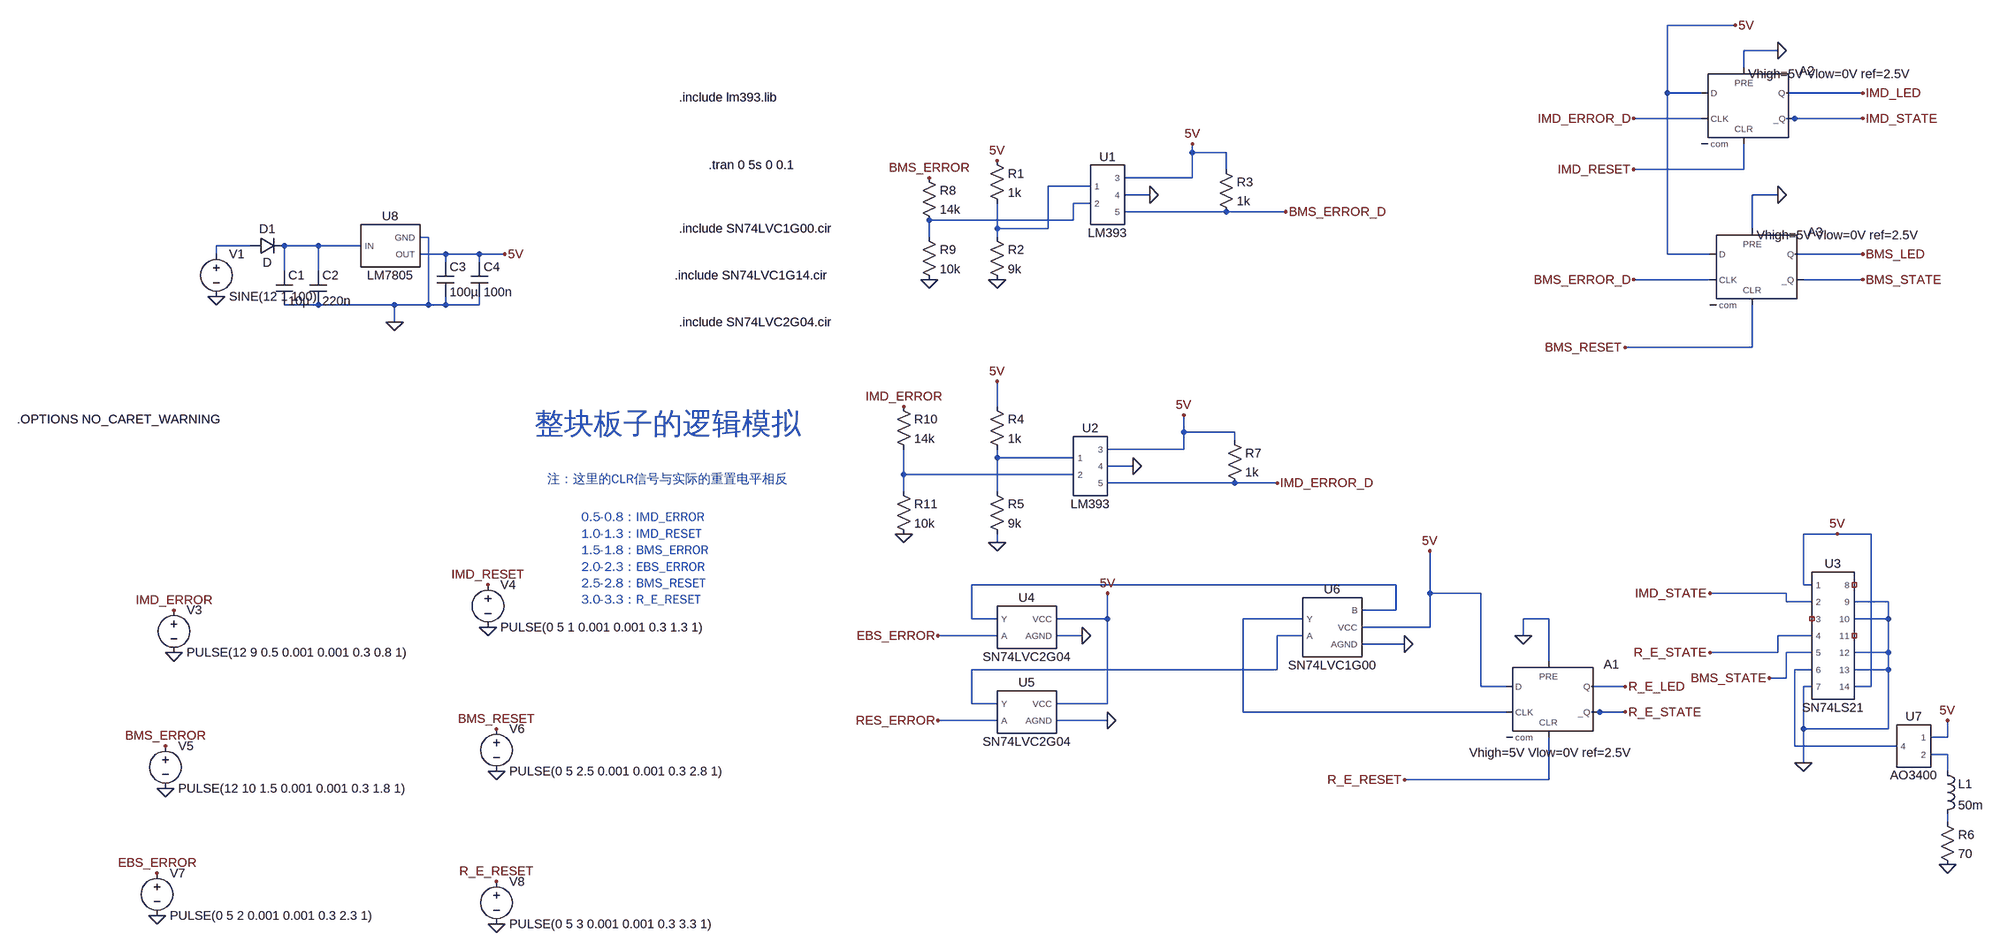
[diagram p0: schematic full.asc]
full.asc, the LTspice schematic file:
Version 4.1
SHEET 1 2420 1492
WIRE 1264 -224 1136 -224
WIRE 1344 -176 1280 -176
WIRE 1280 -144 1280 -176
WIRE 1136 -96 1136 -224
WIRE 1200 -96 1136 -96
WIRE 1504 -96 1360 -96
WIRE 1200 -48 1072 -48
WIRE 1376 -48 1360 -48
WIRE 1504 -48 1376 -48
WIRE 240 16 240 0
WIRE 304 16 240 16
WIRE 304 48 304 16
WIRE 1280 48 1280 0
WIRE 1280 48 1072 48
WIRE 240 64 240 16
WIRE 240 64 112 64
WIRE 48 80 -32 80
WIRE 160 96 112 96
WIRE 1344 96 1296 96
WIRE 48 112 16 112
WIRE 304 128 112 128
WIRE 416 128 304 128
WIRE 16 144 16 112
WIRE 16 144 -256 144
WIRE -128 160 -128 112
WIRE -32 160 -32 80
WIRE -32 160 -128 160
WIRE 1296 160 1296 96
WIRE -1200 176 -1216 176
WIRE -256 176 -256 144
WIRE -128 176 -128 160
WIRE -1536 192 -1600 192
WIRE -1408 192 -1472 192
WIRE -1328 192 -1408 192
WIRE -1600 208 -1600 192
WIRE -1168 208 -1216 208
WIRE -1104 208 -1168 208
WIRE -1056 208 -1104 208
WIRE 1136 208 1136 -96
WIRE 1216 208 1136 208
WIRE 1504 208 1376 208
WIRE -1168 224 -1168 208
WIRE -1104 224 -1104 208
WIRE -1472 240 -1472 192
WIRE -1408 240 -1408 192
WIRE 1216 256 1072 256
WIRE 1504 256 1392 256
WIRE -1408 304 -1472 304
WIRE -1264 304 -1408 304
WIRE -1200 304 -1200 176
WIRE -1200 304 -1264 304
WIRE -1168 304 -1168 288
WIRE -1168 304 -1200 304
WIRE -1104 304 -1104 288
WIRE -1104 304 -1168 304
WIRE -1264 336 -1264 304
WIRE 1296 384 1296 304
WIRE 1296 384 1056 384
WIRE -128 496 -128 448
WIRE 224 544 224 512
WIRE 320 544 224 544
WIRE 320 560 320 544
WIRE 224 576 224 544
WIRE 224 576 80 576
WIRE -128 592 -128 576
WIRE 16 592 -128 592
WIRE 128 608 80 608
WIRE -304 624 -304 576
WIRE 16 624 -304 624
WIRE 320 640 80 640
WIRE 400 640 320 640
WIRE -304 656 -304 624
WIRE -128 656 -128 592
WIRE 1456 736 1392 736
WIRE 1520 736 1456 736
WIRE -128 752 -128 736
WIRE 624 832 -176 832
WIRE 1392 832 1392 736
WIRE 1408 832 1392 832
WIRE 688 848 688 768
WIRE 784 848 688 848
WIRE 1360 848 1216 848
WIRE 1360 864 1360 848
WIRE 1408 864 1360 864
WIRE 1552 864 1488 864
WIRE 624 880 624 832
WIRE 624 880 560 880
WIRE -176 896 -176 832
WIRE -128 896 -176 896
WIRE 80 896 80 848
WIRE 80 896 -16 896
WIRE 448 896 336 896
WIRE 912 896 864 896
WIRE 1552 896 1552 864
WIRE 1552 896 1488 896
WIRE 688 912 688 848
WIRE 688 912 560 912
WIRE -128 928 -240 928
WIRE 32 928 -16 928
WIRE 448 928 400 928
WIRE 864 928 864 896
WIRE 1408 928 1344 928
WIRE 640 944 560 944
WIRE 1344 960 1344 928
WIRE 1344 960 1216 960
WIRE 1408 960 1360 960
WIRE 1552 960 1552 896
WIRE 1552 960 1488 960
WIRE 912 976 912 896
WIRE 400 992 400 928
WIRE 400 992 -176 992
WIRE 1408 992 1376 992
WIRE 1552 992 1552 960
WIRE 1552 992 1488 992
WIRE 1360 1008 1360 960
WIRE 1360 1008 1328 1008
WIRE 784 1024 784 848
WIRE 832 1024 784 1024
WIRE 1056 1024 992 1024
WIRE 1408 1024 1392 1024
WIRE 1520 1024 1520 736
WIRE 1520 1024 1488 1024
WIRE -176 1056 -176 992
WIRE -128 1056 -176 1056
WIRE 80 1056 80 896
WIRE 80 1056 -16 1056
WIRE 336 1072 336 896
WIRE 832 1072 336 1072
WIRE 1008 1072 992 1072
WIRE 1056 1072 1008 1072
WIRE -128 1088 -240 1088
WIRE 80 1088 -16 1088
WIRE 1392 1104 1392 1024
WIRE 1552 1104 1552 992
WIRE 1552 1104 1392 1104
WIRE 1664 1120 1664 1088
WIRE 1664 1120 1632 1120
WIRE 1376 1136 1376 992
WIRE 1568 1136 1376 1136
WIRE 1664 1152 1632 1152
WIRE 1392 1168 1392 1104
WIRE 1664 1184 1664 1152
WIRE 912 1200 912 1120
WIRE 912 1200 640 1200
WIRE 1664 1280 1664 1264
FLAG -128 32 5V
FLAG -128 256 0
FLAG 240 0 5V
FLAG 416 128 BMS_ERROR_D
FLAG -128 448 5V
FLAG -128 752 0
FLAG 224 512 5V
FLAG 400 640 IMD_ERROR_D
FLAG 80 848 5V
FLAG 80 1088 0
FLAG -240 928 EBS_ERROR
FLAG -240 1088 RES_ERROR
FLAG 688 768 5V
FLAG 640 944 0
FLAG 640 1200 R_E_RESET
FLAG 864 928 0
FLAG 1056 1072 R_E_STATE
FLAG 1056 1024 R_E_LED
FLAG 1264 -224 5V
FLAG 1072 -48 IMD_ERROR_D
FLAG 1072 256 BMS_ERROR_D
FLAG 1072 48 IMD_RESET
FLAG 1056 384 BMS_RESET
FLAG 1504 256 BMS_STATE
FLAG 1504 -48 IMD_STATE
FLAG 1504 -96 IMD_LED
FLAG 1504 208 BMS_LED
FLAG 1216 960 R_E_STATE
FLAG 1216 848 IMD_STATE
FLAG 1328 1008 BMS_STATE
FLAG -1680 960 0
FLAG -1680 880 IMD_ERROR
FLAG 32 928 0
FLAG -1088 912 0
FLAG -1088 832 IMD_RESET
FLAG -1696 1216 0
FLAG -1072 1184 0
FLAG -1696 1136 BMS_ERROR
FLAG -1072 1104 BMS_RESET
FLAG -1712 1376 EBS_ERROR
FLAG -1712 1456 0
FLAG -1072 1472 0
FLAG -1072 1392 R_E_RESET
FLAG 1344 96 0
FLAG 1344 -176 0
FLAG 128 608 0
FLAG 160 96 0
FLAG 1392 1168 0
FLAG 1456 736 5V
FLAG 1664 1360 0
FLAG 1664 1088 5V
FLAG -1264 336 0
FLAG -1600 288 0
FLAG -1056 208 5V
FLAG -256 64 BMS_ERROR
FLAG -256 256 0
FLAG -304 496 IMD_ERROR
FLAG -304 736 0
SYMBOL res -144 16 R0
SYMATTR InstName R1
SYMATTR Value 1k
SYMBOL res -144 160 R0
SYMATTR InstName R2
SYMATTR Value 9k
SYMBOL res 288 32 R0
SYMATTR InstName R3
SYMATTR Value 1k
SYMBOL res -144 480 R0
SYMATTR InstName R4
SYMATTR Value 1k
SYMBOL res -144 640 R0
SYMATTR InstName R5
SYMATTR Value 9k
SYMBOL res 304 544 R0
SYMATTR InstName R7
SYMATTR Value 1k
SYMBOL SN74LVC2G04 -80 912 R0
SYMATTR InstName U4
SYMBOL SN74LVC2G04 -80 1072 R0
SYMATTR InstName U5
SYMBOL SN74LVC1G00 496 912 R0
SYMATTR InstName U6
SYMBOL Digital\\dflop 912 976 R0
WINDOW 3 -150 173 Left 2
SYMATTR Value Vhigh=5V Vlow=0V ref=2.5V
SYMATTR InstName A1
SYMBOL Digital\\dflop 1280 -144 R0
WINDOW 3 8 12 Left 2
SYMATTR Value Vhigh=5V Vlow=0V ref=2.5V
SYMATTR InstName A2
SYMBOL Digital\\dflop 1296 160 R0
WINDOW 3 8 12 Left 2
SYMATTR Value Vhigh=5V Vlow=0V ref=2.5V
SYMATTR InstName A3
SYMBOL voltage -1680 864 R0
WINDOW 123 0 0 Left 0
WINDOW 39 0 0 Left 0
SYMATTR InstName V3
SYMATTR Value PULSE(12 9 0.5 0.001 0.001 0.3 0.8 1)
SYMBOL voltage -1088 816 R0
WINDOW 123 0 0 Left 0
WINDOW 39 0 0 Left 0
SYMATTR InstName V4
SYMATTR Value PULSE(0 5 1 0.001 0.001 0.3 1.3 1)
SYMBOL voltage -1696 1120 R0
WINDOW 123 0 0 Left 0
WINDOW 39 0 0 Left 0
SYMATTR InstName V5
SYMATTR Value PULSE(12 10 1.5 0.001 0.001 0.3 1.8 1)
SYMBOL voltage -1072 1088 R0
WINDOW 123 0 0 Left 0
WINDOW 39 0 0 Left 0
SYMATTR InstName V6
SYMATTR Value PULSE(0 5 2.5 0.001 0.001 0.3 2.8 1)
SYMBOL voltage -1712 1360 R0
WINDOW 123 0 0 Left 0
WINDOW 39 0 0 Left 0
SYMATTR InstName V7
SYMATTR Value PULSE(0 5 2 0.001 0.001 0.3 2.3 1)
SYMBOL voltage -1072 1376 R0
WINDOW 123 0 0 Left 0
WINDOW 39 0 0 Left 0
SYMATTR InstName V8
SYMATTR Value PULSE(0 5 3 0.001 0.001 0.3 3.3 1)
SYMBOL LM393 80 96 R0
SYMATTR InstName U1
SYMBOL LM393 48 608 R0
SYMATTR InstName U2
SYMBOL SN74LS21 1440 928 R0
SYMATTR InstName U3
SYMBOL ind 1648 1168 R0
SYMATTR InstName L1
SYMATTR Value 50m
SYMATTR SpiceLine Rser=1m
SYMBOL res 1648 1264 R0
SYMATTR InstName R6
SYMATTR Value 70
SYMBOL AO3400 1600 1136 R0
SYMATTR InstName U7
SYMBOL LM7805 -1280 192 R0
SYMATTR InstName U8
SYMBOL diode -1536 208 R270
WINDOW 0 32 32 VTop 2
WINDOW 3 0 32 VBottom 2
SYMATTR InstName D1
SYMBOL cap -1488 240 R0
SYMATTR InstName C1
SYMATTR Value 10µ
SYMBOL cap -1424 240 R0
SYMATTR InstName C2
SYMATTR Value 220n
SYMBOL cap -1184 224 R0
SYMATTR InstName C3
SYMATTR Value 100µ
SYMBOL cap -1120 224 R0
SYMATTR InstName C4
SYMATTR Value 100n
SYMBOL voltage -1600 192 R0
WINDOW 123 0 0 Left 0
WINDOW 39 0 0 Left 0
SYMATTR InstName V1
SYMATTR Value SINE(12 1 100)
SYMBOL res -272 48 R0
SYMATTR InstName R8
SYMATTR Value 14k
SYMBOL res -272 160 R0
SYMATTR InstName R9
SYMATTR Value 10k
SYMBOL res -320 480 R0
SYMATTR InstName R10
SYMATTR Value 14k
SYMBOL res -320 640 R0
SYMATTR InstName R11
SYMATTR Value 10k
TEXT -728 -88 Left 2 !.include lm393.lib
TEXT -728 160 Left 2 !.include SN74LVC1G00.cir
TEXT -736 248 Left 2 !.include SN74LVC1G14.cir
TEXT -728 336 Left 2 !.include SN74LVC2G04.cir
TEXT -1976 520 Left 2 !.OPTIONS NO_CARET_WARNING
TEXT -672 40 Left 2 !.tran 0 5s 0 0.1
TEXT -1000 528 Left 5 ;整块板子的逻辑模拟
TEXT -976 632 Left 2 ;注：这里的CLR信号与实际的重置电平相反
TEXT -912 704 Left 2 ;0.5-0.8：IMD_ERROR\n1.0-1.3：IMD_RESET\n1.5-1.8：BMS_ERROR\n2.0-2.3：EBS_ERROR\n2.5-2.8：BMS_RESET\n3.0-3.3：R_E_RESET

The netlist it stands for:
* full.asc
R1 5V N001 1k
R2 N001 0 9k
R3 5V BMS_ERROR_D 1k
R4 5V N005 1k
R5 N005 0 9k
R7 5V IMD_ERROR_D 1k
X§U4 N007 EBS_ERROR 5V 0 SN74LVC2G04  ; pins Y A VCC AGND
X§U5 N009 RES_ERROR 5V 0 SN74LVC2G04  ; pins Y A VCC AGND
X§U6 N008 N009 N007 5V 0 SN74LVC1G00  ; pins Y A B VCC AGND
A1 5V 0 N008 0 R_E_RESET R_E_STATE R_E_LED 0 DFLOP Vhigh=5V Vlow=0V ref=2.5V
A2 5V 0 IMD_ERROR_D 0 IMD_RESET IMD_STATE IMD_LED 0 DFLOP Vhigh=5V Vlow=0V ref=2.5V
A3 5V 0 BMS_ERROR_D 0 BMS_RESET BMS_STATE BMS_LED 0 DFLOP Vhigh=5V Vlow=0V ref=2.5V
V3 IMD_ERROR 0 PULSE(12 9 0.5 0.001 0.001 0.3 0.8 1)
V4 IMD_RESET 0 PULSE(0 5 1 0.001 0.001 0.3 1.3 1)
V5 BMS_ERROR 0 PULSE(12 10 1.5 0.001 0.001 0.3 1.8 1)
V6 BMS_RESET 0 PULSE(0 5 2.5 0.001 0.001 0.3 2.8 1)
V7 EBS_ERROR 0 PULSE(0 5 2 0.001 0.001 0.3 2.3 1)
V8 R_E_RESET 0 PULSE(0 5 3 0.001 0.001 0.3 3.3 1)
X§U1 N001 N002 5V 0 BMS_ERROR_D LM393  ; pins 1 2 3 4 5
X§U2 N005 N006 5V 0 IMD_ERROR_D LM393  ; pins 1 2 3 4 5
X§U3 5V IMD_STATE NC_01 R_E_STATE BMS_STATE N010 0 NC_02 0 0 NC_03 0 0 5V SN74LS21  ; pins 1 2 3 4 5 6 7 8 9 10 11 12 13 14
L1 N011 N012 50m Rser=1m
R6 N012 0 70
X§U7 N010 5V N011 AO3400  ; pins 4 1 2
X§U8 N004 0 5V LM7805  ; pins IN GND OUT
D1 N003 N004 D
C1 N004 0 10µ
C2 N004 0 220n
C3 5V 0 100µ
C4 5V 0 100n
V1 N003 0 SINE(12 1 100)
R8 BMS_ERROR N002 14k
R9 N002 0 10k
R10 IMD_ERROR N006 14k
R11 N006 0 10k
.model D D
.lib standard.dio
.include lm393.lib
.include SN74LVC1G00.cir
.include SN74LVC1G14.cir
.include SN74LVC2G04.cir
.OPTIONS NO_CARET_WARNING
.tran 0 5s 0 0.1
* 整块板子的逻辑模拟
* 注：这里的CLR信号与实际的重置电平相反
* 0.5-0.8：IMD_ERROR
* 1.0-1.3：IMD_RESET
* 1.5-1.8：BMS_ERROR
* 2.0-2.3：EBS_ERROR
* 2.5-2.8：BMS_RESET
* 3.0-3.3：R_E_RESET
.lib SN74LVC2G04.cir
.lib SN74LVC1G00.cir
.lib LM393.sub
.lib SN74LS21.lib
.lib AO3480A.lib
.lib power1.lib
.backanno
.end